# EAGLE schematic MPU9250-IMU(I2C_V1) (EAGLE 6.5.0)
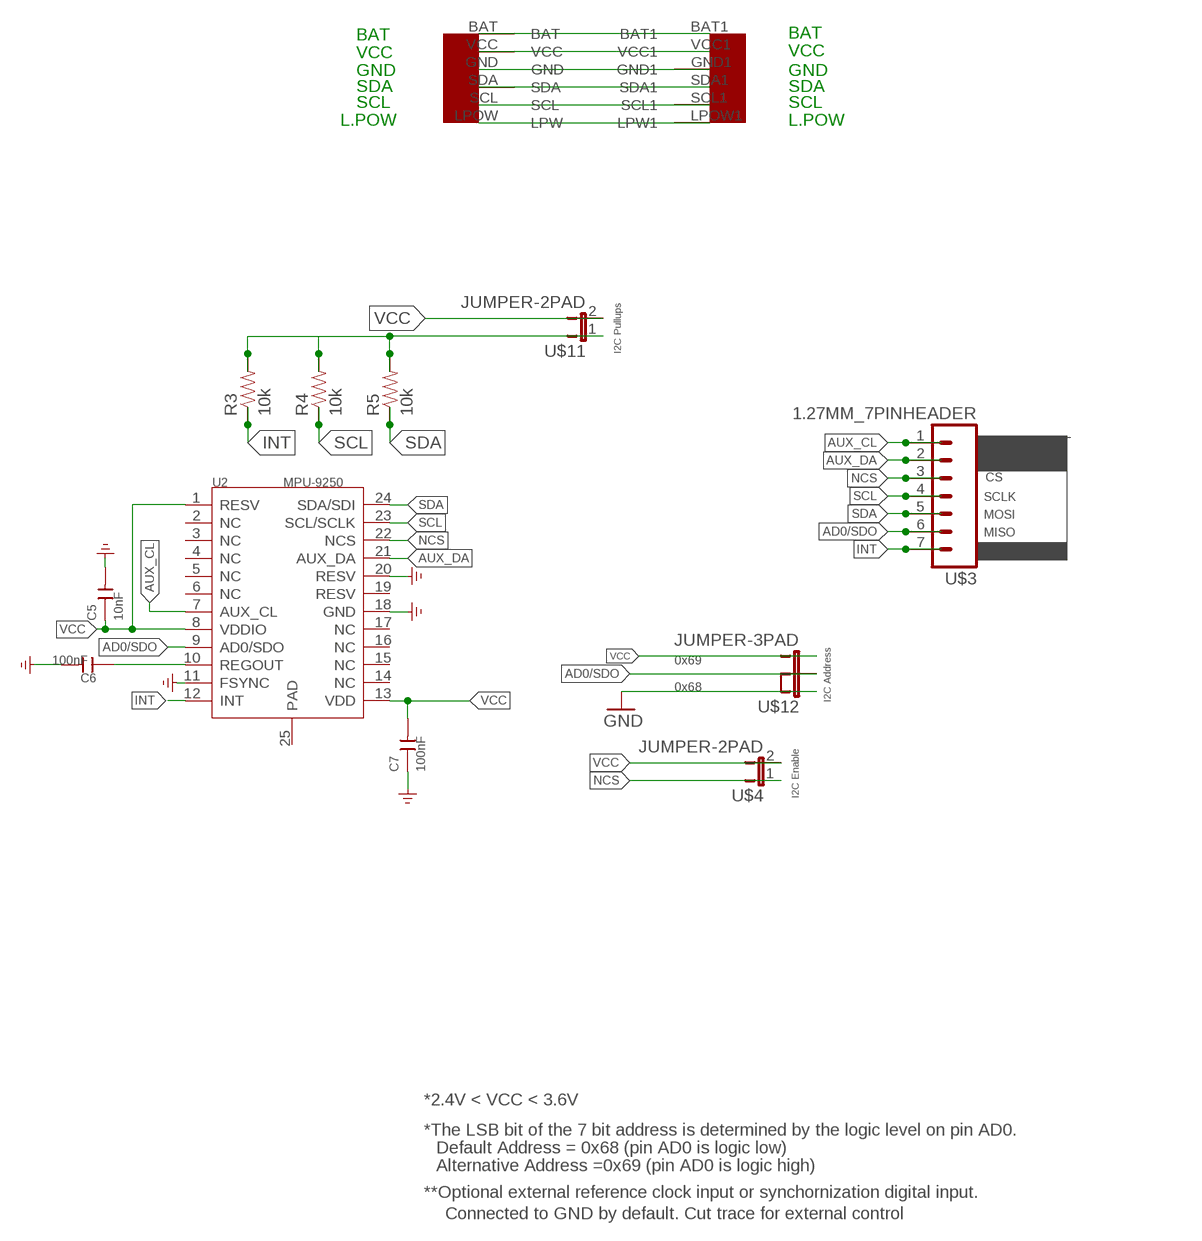
[diagram p0: schematic, sheet 1]

## Parts
C5  10nF  CAP-0603  [C0603]
C6  100nF  CAP-0603  [C0603]
C7  100nF  CAP-0603  [C0603]
R3  10k  RESISTOR0402-RES  [0402-RES]
R4  10k  RESISTOR0402-RES  [0402-RES]
R5  10k  RESISTOR0402-RES  [0402-RES]
U2  MPU-9250  [LEAD-QFN24]
U$1  EZ-I2CHEADERV1  [EZ-I2CHEADERV1]
U$3  1.27MM_7PINHEADER  [1.27MM_7PINHEADER]
U$4  JUMPER-2PAD  [JUMPER-2PAD]
U$11  JUMPER-2PAD  [JUMPER-2PAD]
U$12  JUMPER-3PAD  [JUMPER-3PAD]

## Nets
AD0/SDO: U2.9(AD0/SDO) U$3.6 U$12.2
AUX_CL: U2.7(AUX_CL) U$3.1
AUX_DA: U2.21(AUX_DA) U$3.2
BAT: U$1.BAT U$1.BAT1
GND: C5.2 C6.2 C7.1 U2.11(FSYNC) U2.18(GND) U2.20(RESV) U$1.GND U$1.GND1 U$12.1 ; supply symbol labelled GND_POWER
INT: R3.1 U2.12(INT) U$3.7
N$5: C6.1 U2.10(REGOUT)
N$6: U$1.LPOW1(LPW1) U$1.LPOW(LPW)
N$11: R3.2 R4.2 R5.2 U$11.1
NCS: U2.22(NCS) U$3.3 U$4.1
SCL: R4.1 U2.23(SCL/SCLK) U$1.SCL U$1.SCL1 U$3.4
SDA: R5.1 U2.24(SDA/SDI) U$1.SDA U$1.SDA1 U$3.5
VCC: C5.1 C7.2 U2.1(RESV) U2.8(VDDIO) U2.13(VDD) U$1.VCC U$1.VCC1 U$4.2 U$11.2 U$12.3
Unconnected: U2.2(NC) U2.3(NC) U2.4(NC) U2.5(NC) U2.6(NC) U2.14(NC) U2.15(NC) U2.16(NC) U2.17(NC) U2.19(RESV) U2.25(PAD)

## Notes on the sheet
- BAT | BAT
- VCC | VCC
- GND | GND
- SDA | SDA
- SCL | SCL
- L.POW | L.POW
- I2C Pullups
- CL
- DA
- CS
- SCLK
- MOSI
- MISO
- 0x69
- 0x68
- I2C Address
- I2C Enable
- *2.4V < VCC < 3.6V
- *The LSB bit of the 7 bit address is determined by the logic level on pin AD0.
- Default Address = 0x68 (pin AD0 is logic low)
- Alternative Address =0x69 (pin AD0 is logic high)
- **Optional external reference clock input or synchornization digital input.
- Connected to GND by default. Cut trace for external control

## Library data of the parts
C5-C7 = Discrete-new:CAP: Ceramic Capacitors
R3-R5 = SparkFun-Passives:RESISTOR: Resistor Basic schematic elements and footprints for 0603, 1206, and PTH resistors.; OC_FARNELL: unknown
U2 = template:MPU-9250
U$1 = UniqueInteractionsLib:EZ-I2CHEADERV1
U$3 = UniqueInteractionsLib:1.27MM_7PINHEADER
U$4 U$11 = UniqueInteractionsLib:JUMPER-2PAD
U$12 = UniqueInteractionsLib:JUMPER-3PAD